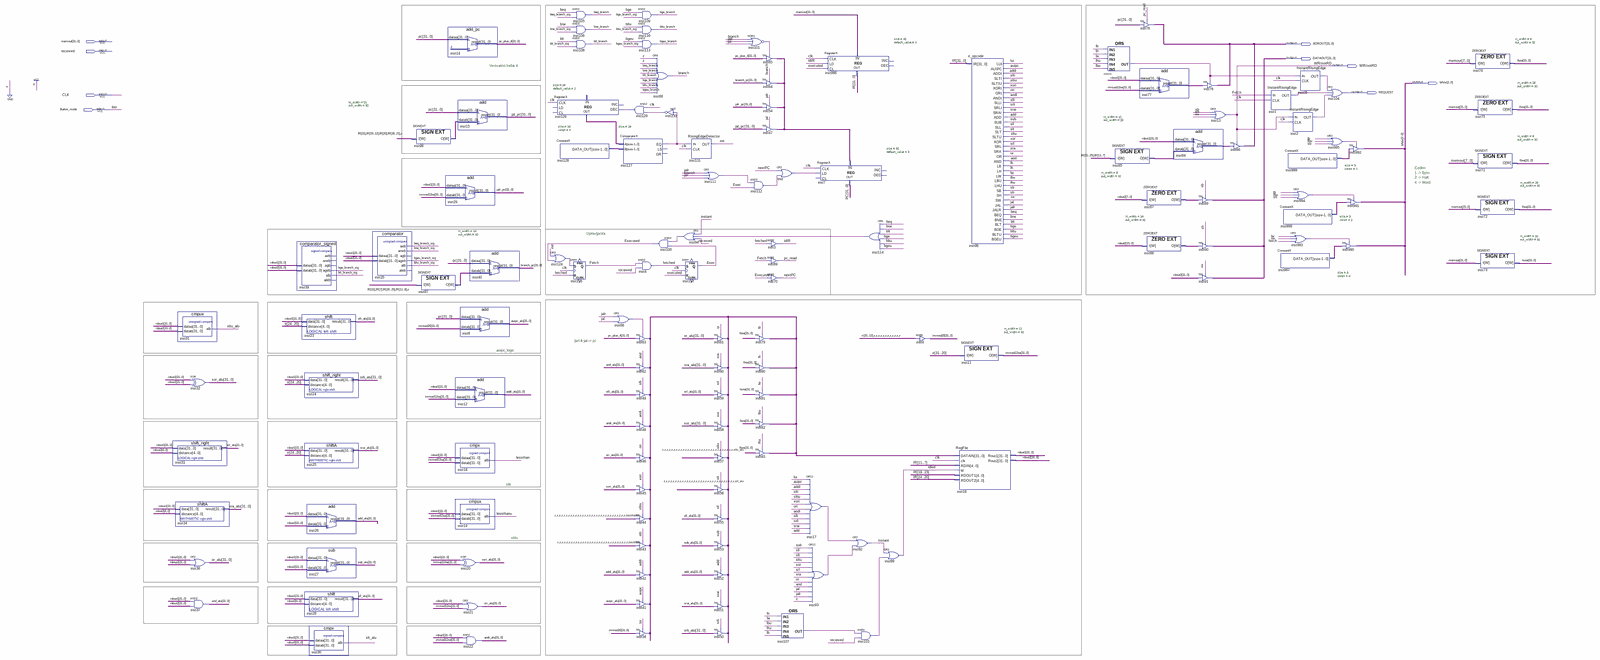
[diagram p0: schematic sheet, whole]
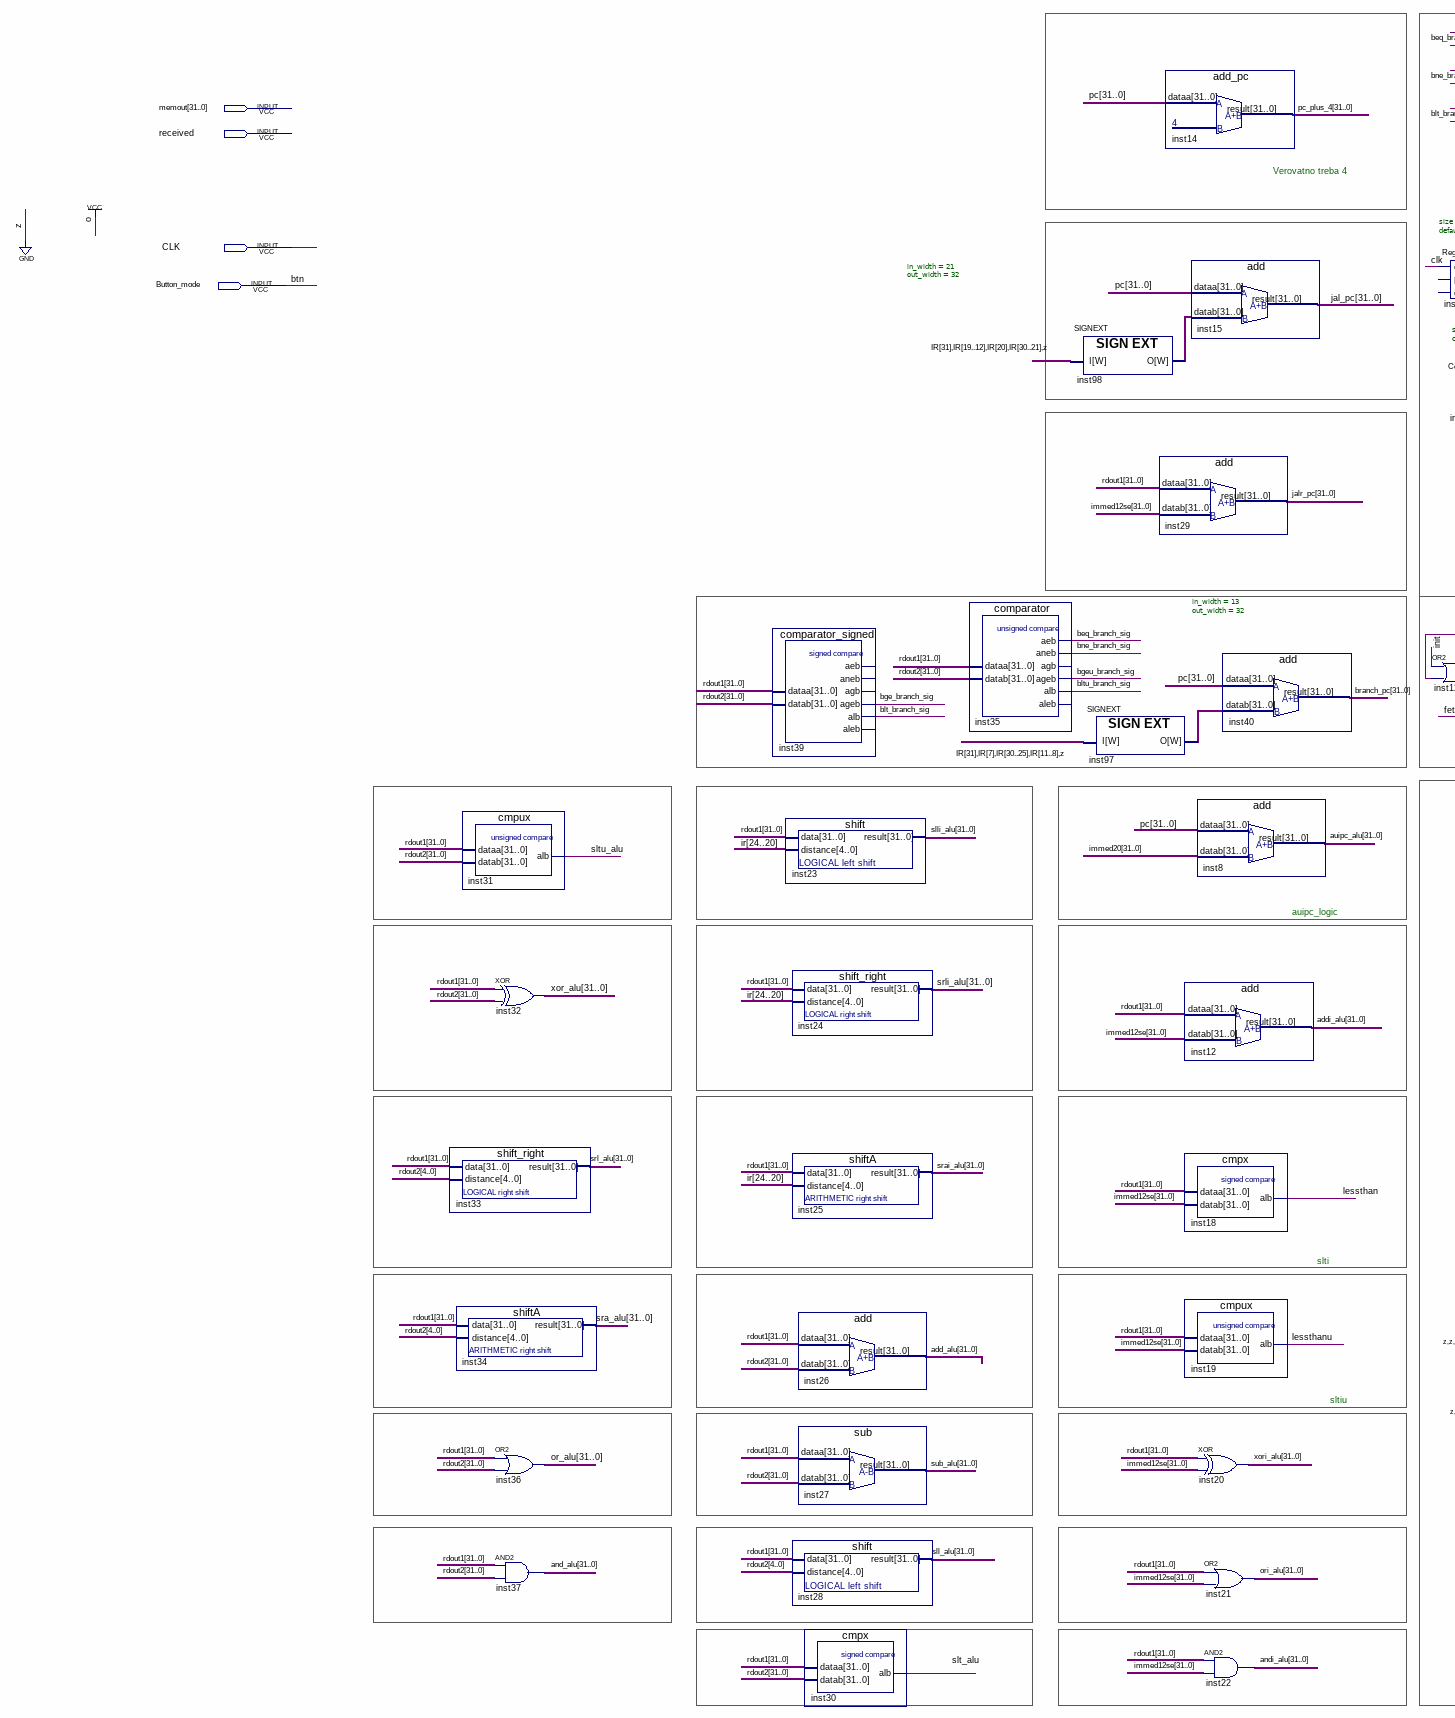
[diagram p1: schematic sheet, left part]
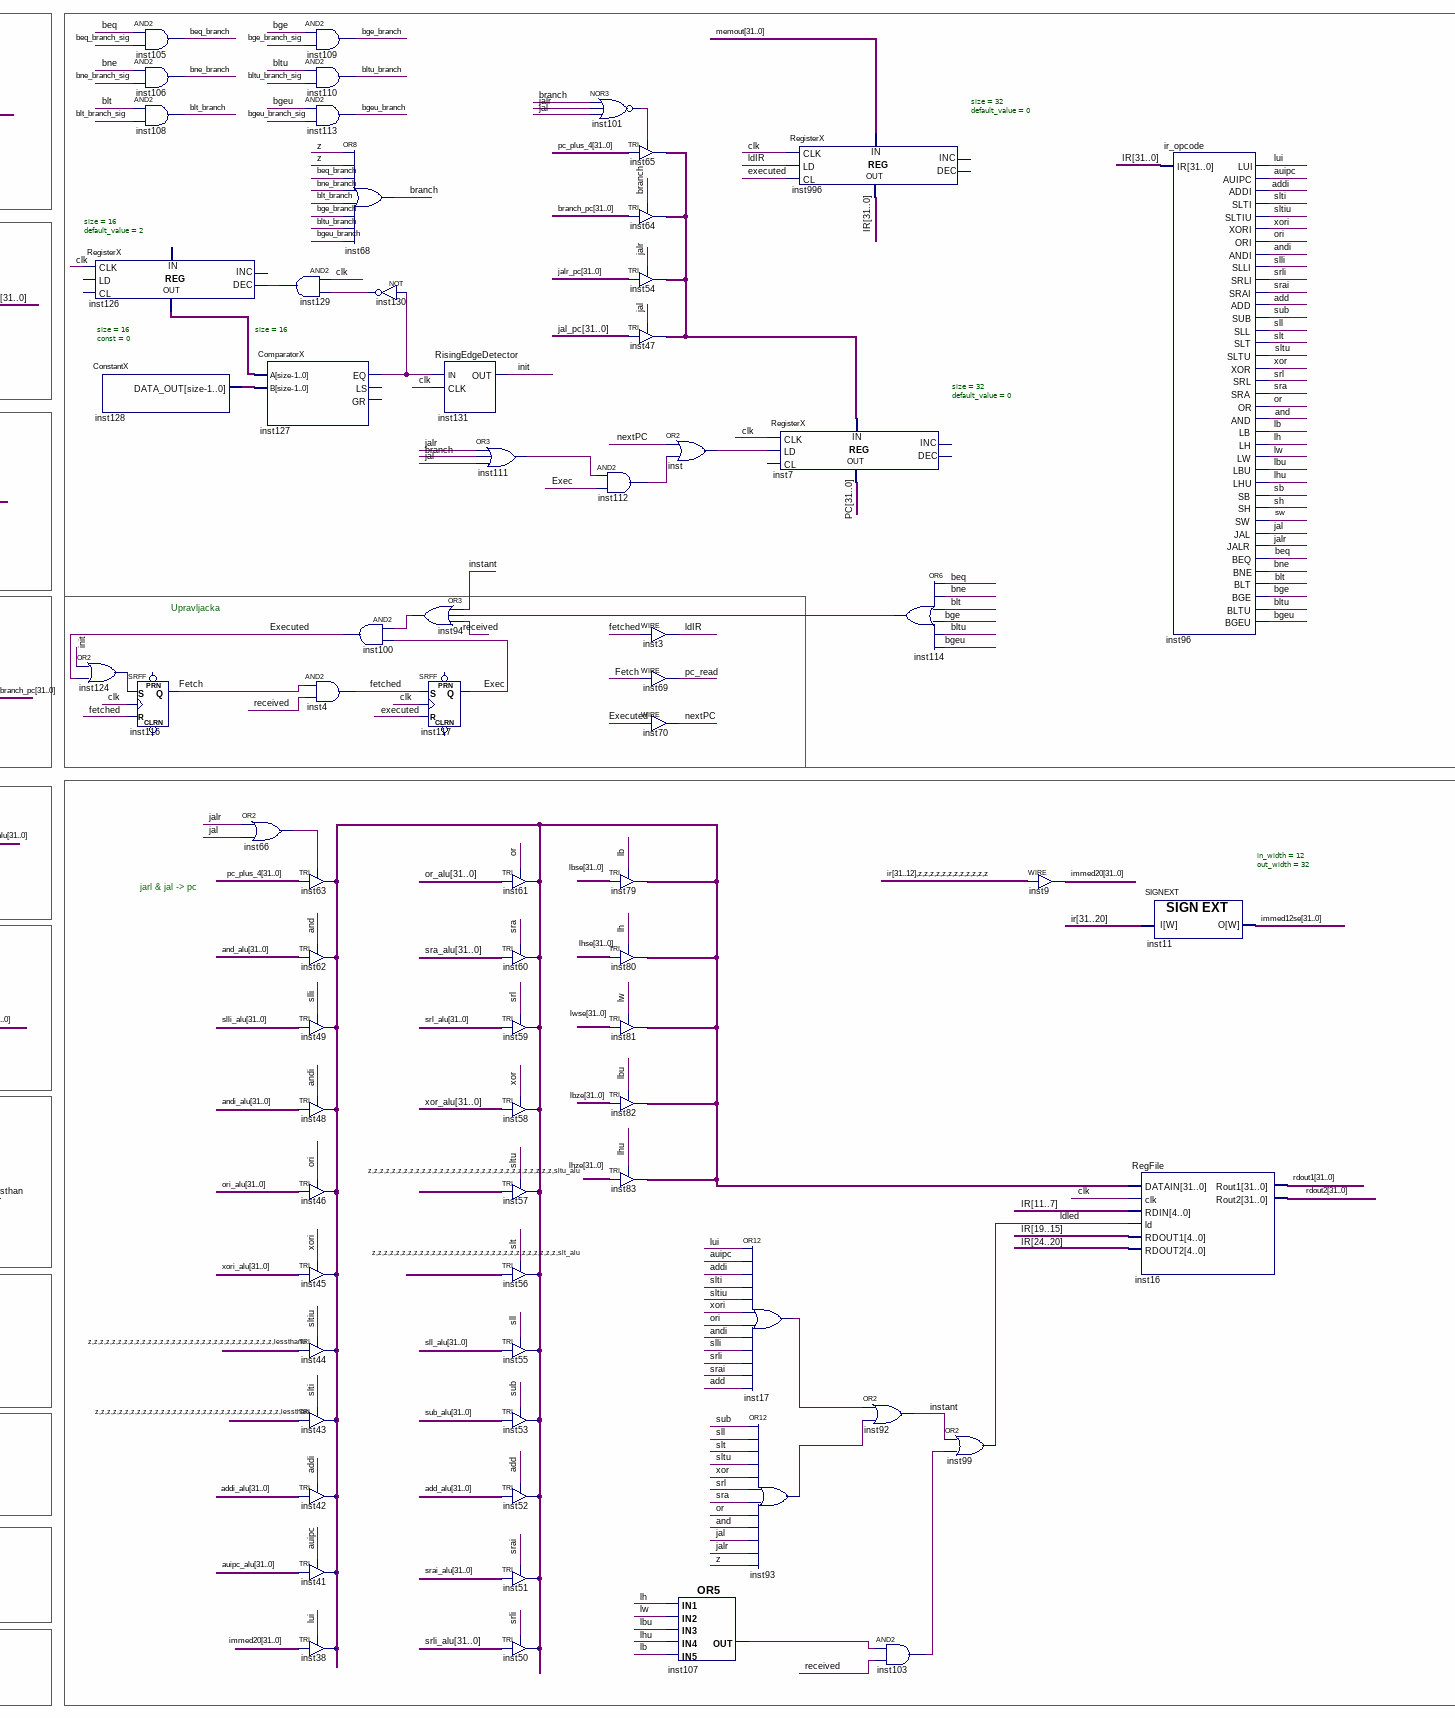
[diagram p2: schematic sheet, centre part]
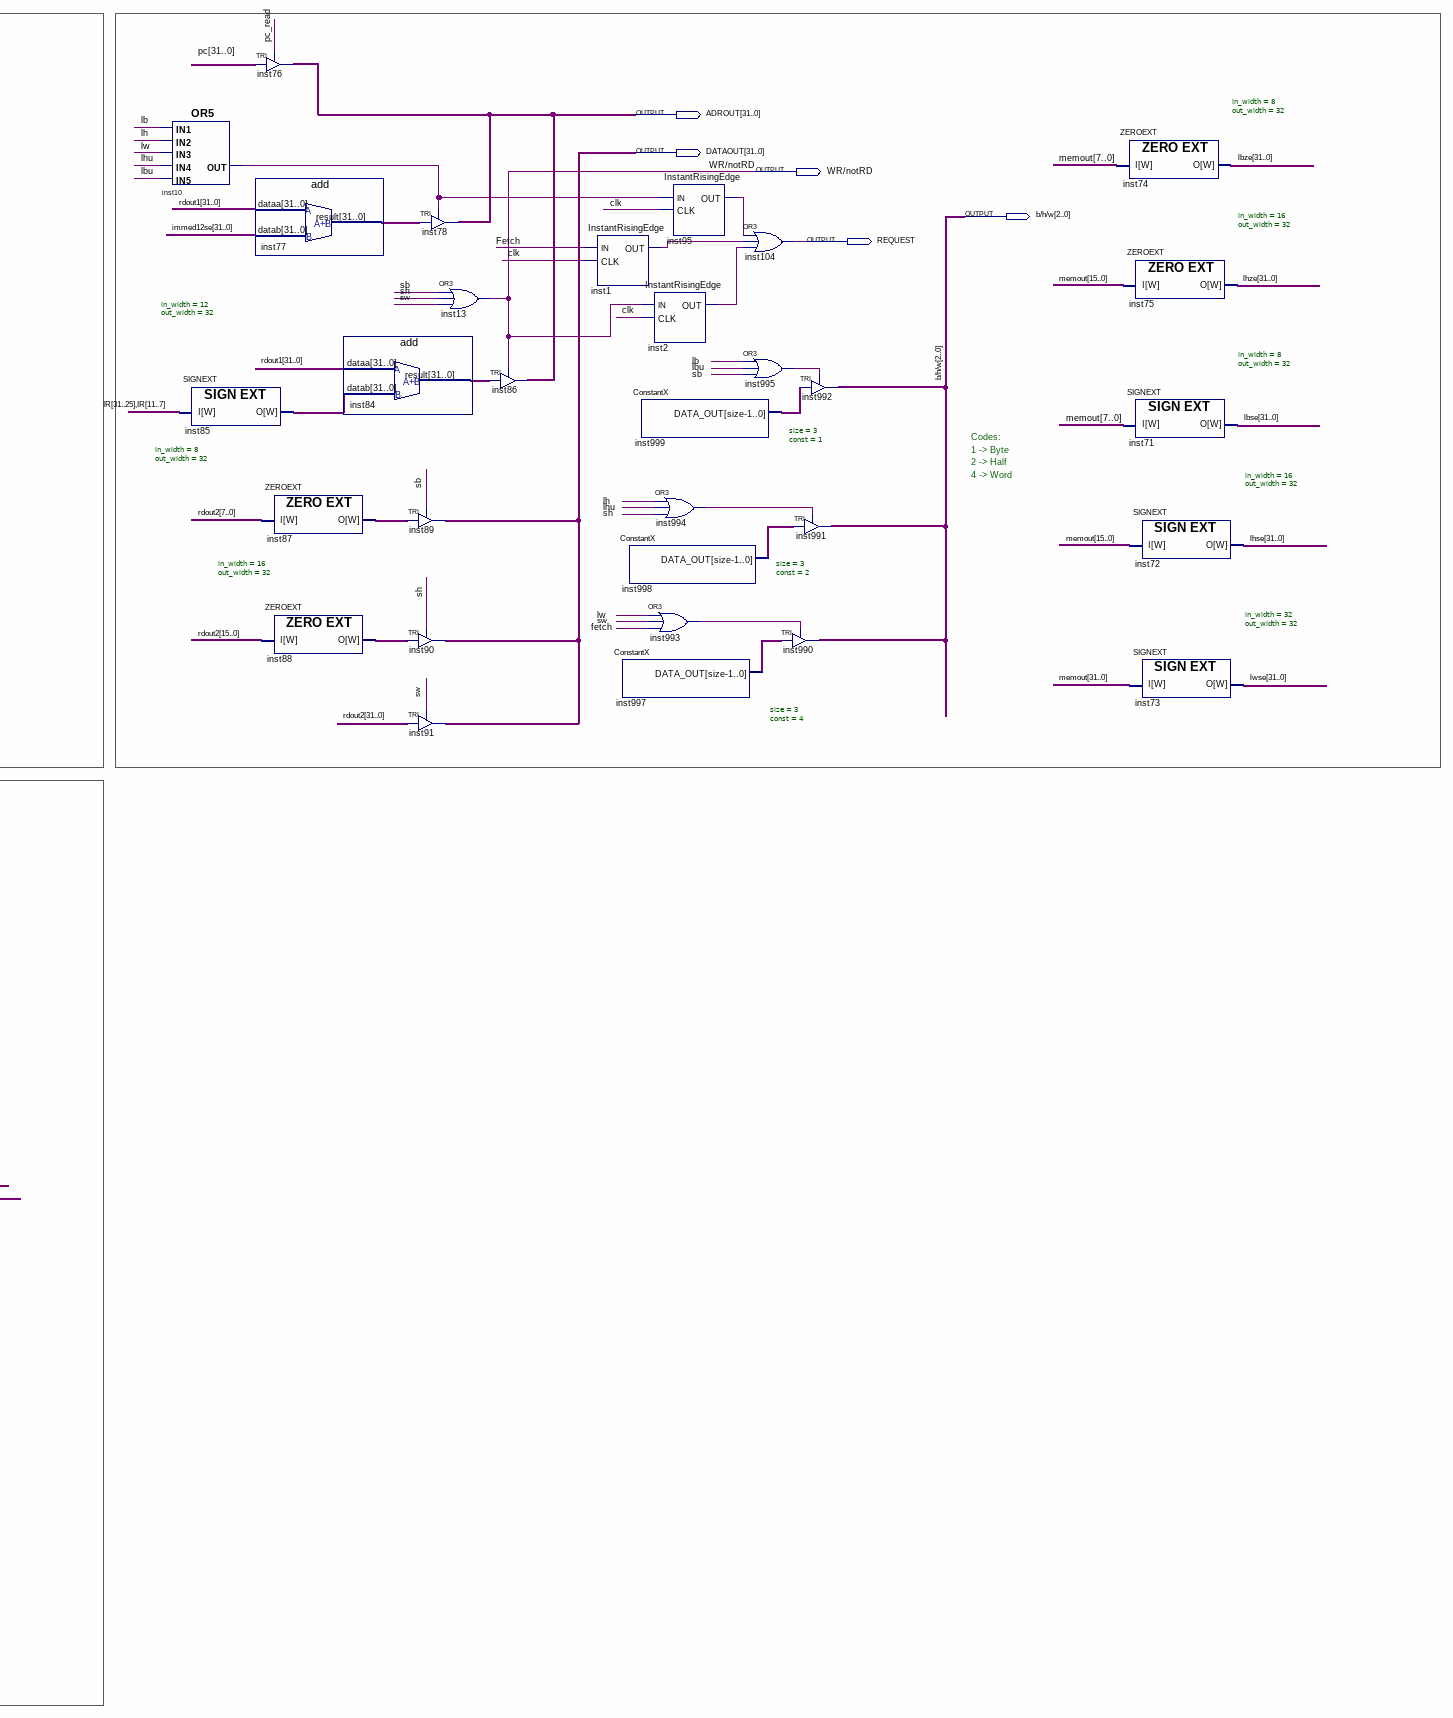
[diagram p3: schematic sheet, right part]
// Quartus schematic CPU.bdf as structural Verilog: 130 symbols, 9 pins
module CPU (
  input  [31:0] memout,
  input  received,
  input  CLK,
  input  Button_mode,
  output [31:0] ADROUT,
  output [31:0] DATAOUT,
  output \WR/notRD ,
  output [2:0] \b/h/w ,
  output REQUEST
);

  wire add, addi, \and , andi, auipc, beq, beq_branch, beq_branch_sig, bge, bge_branch, bge_branch_sig, bgeu,
       bgeu_branch, bgeu_branch_sig, blt, blt_branch, blt_branch_sig, bltu, bltu_branch, bltu_branch_sig,
       bne, bne_branch, bne_branch_sig, branch, Exec, Executed, Fetch, fetched, init, inst1_out, inst2_out,
       inst10_out, inst17_out, inst66_out, inst93_out, inst94_out, inst95_out, inst101_out, inst103_out,
       inst107_out, inst111_out, inst112_out, inst114_out, inst124_out, inst127_eq, inst129_out, inst130_out,
       inst993_out, inst994_out, inst995_out, inst_out, instant, jal, jalr, lb, lbu, ldIR, ldled, lessthan,
       lessthanu, lh, lhu, lui, lw, nextPC, \or , ori, pc_read, sb, sh, sll, slli, slt, slt_alu, slti, sltiu,
       sltu, sltu_alu, sra, srai, srl, srli, sub, sw, \xor , xori;
  wire [2:0] inst997_data_out, inst998_data_out, inst999_data_out;
  wire [15:0] inst126_data_out, inst128_data_out;
  wire [31:0] add_alu, addi_alu, and_alu, andi_alu, auipc_alu, branch_pc, immed12se, immed20, inst63_out,
       inst65_out, inst77_result, inst84_result, inst85_o, inst87_o, inst88_o, inst97_o, inst98_o, ir,
       jal_pc, jalr_pc, lbse, lbze, lhse, lhze, lwse, or_alu, ori_alu, pc, pc_plus_4, rdout1, rdout2,
       sll_alu, slli_alu, sra_alu, srai_alu, srl_alu, srli_alu, sub_alu, xor_alu, xori_alu;

  shift_right inst33 (.data(rdout1), .distance(rdout2[4:0]), .result(srl_alu));
  cmpux inst31 (.dataa(rdout1), .datab(rdout2), .alb(sltu_alu));
  assign xor_alu = rdout1 ^ rdout2;  // XOR inst32, 32 bits wide
  shiftA inst34 (.data(rdout1), .distance(rdout2[4:0]), .result(sra_alu));
  assign or_alu = rdout1 | rdout2;  // OR2 inst36, 32 bits wide
  assign and_alu = rdout1 & rdout2;  // AND2 inst37, 32 bits wide
  comparator_signed inst39 (
    .dataa(rdout1), .datab(rdout2), .ageb(bge_branch_sig), .alb(blt_branch_sig));  // open: aeb, aneb, agb, aleb
  shift inst23 (.data(rdout1), .distance(ir[24:20]), .result(slli_alu));
  shift_right inst24 (.data(rdout1), .distance(ir[24:20]), .result(srli_alu));
  shiftA inst25 (.data(rdout1), .distance(ir[24:20]), .result(srai_alu));
  add inst26 (.dataa(rdout1), .datab(rdout2), .result(add_alu));
  sub inst27 (.dataa(rdout1), .datab(rdout2), .result(sub_alu));
  shift inst28 (.data(rdout1), .distance(rdout2[4:0]), .result(sll_alu));
  cmpx inst30 (.dataa(rdout1), .datab(rdout2), .alb(slt_alu));
  comparator inst35 (
    .dataa(rdout1), .datab(rdout2), .aeb(beq_branch_sig), .aneb(bne_branch_sig), .ageb(bgeu_branch_sig),
    .alb(bltu_branch_sig));  // open: agb, aleb
  SIGNEXT #(.in_width(21), .out_width(32)) inst98 (.I({ir[31], ir[19:12], ir[20], ir[30:21], 1'b0}), .O(inst98_o));
  SIGNEXT #(.in_width(13), .out_width(32)) inst97 (.I({ir[31], ir[7], ir[30:25], ir[11:8], 1'b0}), .O(inst97_o));
  add inst29 (.dataa(rdout1), .datab(immed12se), .result(jalr_pc));
  add_pc inst14 (.dataa(pc), .result(pc_plus_4));
  add inst15 (.dataa(pc), .datab(inst98_o), .result(jal_pc));
  add inst8 (.dataa(pc), .datab(immed20), .result(auipc_alu));
  add inst12 (.dataa(rdout1), .datab(immed12se), .result(addi_alu));
  cmpx inst18 (.dataa(rdout1), .datab(immed12se), .alb(lessthan));
  cmpux inst19 (.dataa(rdout1), .datab(immed12se), .alb(lessthanu));
  assign xori_alu = rdout1 ^ immed12se;  // XOR inst20, 32 bits wide
  assign ori_alu = rdout1 | immed12se;  // OR2 inst21, 32 bits wide
  assign andi_alu = rdout1 & immed12se;  // AND2 inst22, 32 bits wide
  add inst40 (.dataa(pc), .datab(inst97_o), .result(branch_pc));
  RegisterX #(.size(16), .default_value(2)) inst126 (
    .CLK(CLK), .DEC(inst129_out), .DATA_OUT(inst126_data_out));  // open: LD, CL, INC, DATA_IN
  ConstantX #(.size(16), .\const (0)) inst128 (.DATA_OUT(inst128_data_out));
  or inst124 (inst124_out, init, Executed);
  and inst105 (beq_branch, beq, beq_branch_sig);
  and inst106 (bne_branch, bne, bne_branch_sig);
  and inst108 (blt_branch, blt, blt_branch_sig);
  SRFF inst116 (.S(inst124_out), .R(fetched), .CLK(CLK), .Q(Fetch));  // open: PRN, CLRN
  ComparatorX #(.size(16)) inst127 (.A(inst126_data_out), .B(inst128_data_out), .EQ(inst127_eq));  // open: LS, GR
  or inst66 (inst66_out, jalr, jal);
  and inst109 (bge_branch, bge, bge_branch_sig);
  and inst110 (bltu_branch, bltu, bltu_branch_sig);
  and inst113 (bgeu_branch, bgeu, bgeu_branch_sig);
  and inst129 (inst129_out, CLK, inst130_out);
  and inst4 (fetched, Fetch, received);
  TRI inst63[31:0] (.IN(pc_plus_4), .OE(inst66_out), .OUT(inst63_out));
  TRI inst62[31:0] (.IN(and_alu), .OE(\and ), .OUT(inst63_out));
  TRI inst49[31:0] (.IN(slli_alu), .OE(slli), .OUT(inst63_out));
  TRI inst48[31:0] (.IN(andi_alu), .OE(andi), .OUT(inst63_out));
  TRI inst46[31:0] (.IN(ori_alu), .OE(ori), .OUT(inst63_out));
  TRI inst45[31:0] (.IN(xori_alu), .OE(xori), .OUT(inst63_out));
  TRI inst44[31:0] (.IN({{31{1'b0}}, lessthanu}), .OE(sltiu), .OUT(inst63_out));
  TRI inst43[31:0] (.IN({{31{1'b0}}, lessthan}), .OE(slti), .OUT(inst63_out));
  TRI inst42[31:0] (.IN(addi_alu), .OE(addi), .OUT(inst63_out));
  TRI inst41[31:0] (.IN(auipc_alu), .OE(auipc), .OUT(inst63_out));
  TRI inst38[31:0] (.IN(immed20), .OE(lui), .OUT(inst63_out));
  or inst68 (branch, 1'b0, 1'b0, beq_branch, bne_branch, blt_branch, bge_branch, bltu_branch, bgeu_branch);
  and inst100 (Executed, inst94_out, Exec);
  not inst130 (inst130_out, inst127_eq);
  or inst94 (inst94_out, instant, inst114_out, received);
  RisingEdgeDetector inst131 (.IN(inst127_eq), .CLK(CLK), .OUT(init));
  SRFF inst117 (.S(fetched), .R(Executed), .CLK(CLK), .Q(Exec));  // open: PRN, CLRN
  or inst111 (inst111_out, jalr, branch, jal);
  TRI inst61[31:0] (.IN(or_alu), .OE(\or ), .OUT(inst63_out));
  TRI inst60[31:0] (.IN(sra_alu), .OE(sra), .OUT(inst63_out));
  TRI inst59[31:0] (.IN(srl_alu), .OE(srl), .OUT(inst63_out));
  TRI inst58[31:0] (.IN(xor_alu), .OE(\xor ), .OUT(inst63_out));
  TRI inst57[31:0] (.IN({{31{1'b0}}, sltu_alu}), .OE(sltu), .OUT(inst63_out));
  TRI inst56[31:0] (.IN({{31{1'b0}}, slt_alu}), .OE(slt), .OUT(inst63_out));
  TRI inst55[31:0] (.IN(sll_alu), .OE(sll), .OUT(inst63_out));
  TRI inst53[31:0] (.IN(sub_alu), .OE(sub), .OUT(inst63_out));
  TRI inst52[31:0] (.IN(add_alu), .OE(add), .OUT(inst63_out));
  TRI inst51[31:0] (.IN(srai_alu), .OE(srai), .OUT(inst63_out));
  TRI inst50[31:0] (.IN(srli_alu), .OE(srli), .OUT(inst63_out));
  nor inst101 (inst101_out, branch, jalr, jal);
  and inst112 (inst112_out, inst111_out, Exec);
  TRI inst79[31:0] (.IN(lbse), .OE(lb), .OUT(inst63_out));
  TRI inst80[31:0] (.IN(lhse), .OE(lh), .OUT(inst63_out));
  TRI inst81[31:0] (.IN(lwse), .OE(lw), .OUT(inst63_out));
  TRI inst82[31:0] (.IN(lbze), .OE(lbu), .OUT(inst63_out));
  TRI inst83[31:0] (.IN(lhze), .OE(lhu), .OUT(inst63_out));
  TRI inst65[31:0] (.IN(pc_plus_4), .OE(inst101_out), .OUT(inst65_out));
  TRI inst64[31:0] (.IN(branch_pc), .OE(branch), .OUT(inst65_out));
  TRI inst54[31:0] (.IN(jalr_pc), .OE(jalr), .OUT(inst65_out));
  TRI inst47[31:0] (.IN(jal_pc), .OE(jal), .OUT(inst65_out));
  or inst (inst_out, nextPC, inst112_out);
  assign ldIR = fetched;  // WIRE inst3
  assign pc_read = Fetch;  // WIRE inst69
  assign nextPC = Executed;  // WIRE inst70
  or inst107 (inst107_out, lh, lw, lbu, lhu, lb);
  RegisterX #(.size(32), .default_value(0)) inst7 (
    .CLK(CLK), .LD(inst_out), .DATA_IN(inst65_out), .DATA_OUT(pc));  // open: CL, INC, DEC
  or inst17 (inst17_out, lui, auipc, addi, slti, sltiu, xori, ori, andi, slli, srli, srai, add);
  or inst93 (inst93_out, sub, sll, slt, sltu, \xor , srl, sra, \or , \and , jal, jalr, 1'b0);
  RegisterX #(.size(32), .default_value(0)) inst996 (
    .CLK(CLK), .LD(ldIR), .CL(Executed), .DATA_IN(memout), .DATA_OUT(ir));  // open: INC, DEC
  or inst92 (instant, inst17_out, inst93_out);
  or inst114 (inst114_out, beq, bne, blt, bge, bltu, bgeu);
  and inst103 (inst103_out, inst107_out, received);
  or inst99 (ldled, instant, inst103_out);
  assign immed20 = {ir[31:12], {12{1'b0}}};  // WIRE inst9
  ir_opcode inst96 (
    .IR(ir), .LUI(lui), .AUIPC(auipc), .ADDI(addi), .SLTI(slti), .SLTIU(sltiu), .XORI(xori), .ORI(ori),
    .ANDI(andi), .SLLI(slli), .SRLI(srli), .SRAI(srai), .ADD(add), .SUB(sub), .SLL(sll), .SLT(slt),
    .SLTU(sltu), .XOR(\xor ), .SRL(srl), .SRA(sra), .OR(\or ), .AND(\and ), .LB(lb), .LH(lh), .LW(lw),
    .LBU(lbu), .LHU(lhu), .SB(sb), .SH(sh), .SW(sw), .JAL(jal), .JALR(jalr), .BEQ(beq), .BNE(bne), .BLT(blt),
    .BGE(bge), .BLTU(bltu), .BGEU(bgeu));
  SIGNEXT #(.in_width(12), .out_width(32)) inst11 (.I(ir[31:20]), .O(immed12se));
  RegFile inst16 (
    .DATAIN(inst63_out), .clk(CLK), .RDIN(ir[11:7]), .ld(ldled), .RDOUT1(ir[19:15]), .RDOUT2(ir[24:20]),
    .Rout1(rdout1), .Rout2(rdout2));
  or inst10 (inst10_out, lb, lh, lw, lhu, lbu);
  SIGNEXT #(.in_width(12), .out_width(32)) inst85 (.I({ir[31:25], ir[11:7]}), .O(inst85_o));
  TRI inst76[31:0] (.IN(pc), .OE(pc_read), .OUT(ADROUT));
  add inst77 (.dataa(rdout1), .datab(immed12se), .result(inst77_result));
  ZEROEXT #(.in_width(8), .out_width(32)) inst87 (.I(rdout2[7:0]), .O(inst87_o));
  ZEROEXT #(.in_width(16), .out_width(32)) inst88 (.I(rdout2[15:0]), .O(inst88_o));
  add inst84 (.dataa(rdout1), .datab(inst85_o), .result(inst84_result));
  TRI inst78[31:0] (.IN(inst77_result), .OE(inst10_out), .OUT(ADROUT));
  TRI inst89[31:0] (.IN(inst87_o), .OE(sb), .OUT(DATAOUT));
  TRI inst90[31:0] (.IN(inst88_o), .OE(sh), .OUT(DATAOUT));
  TRI inst91[31:0] (.IN(rdout2), .OE(sw), .OUT(DATAOUT));
  or inst13 (\WR/notRD , sb, sh, sw);
  TRI inst86[31:0] (.IN(inst84_result), .OE(\WR/notRD ), .OUT(ADROUT));
  InstantRisingEdge inst1 (.IN(Fetch), .CLK(CLK), .OUT(inst1_out));
  ConstantX #(.size(3), .\const (1)) inst999 (.DATA_OUT(inst999_data_out));
  ConstantX #(.size(3), .\const (2)) inst998 (.DATA_OUT(inst998_data_out));
  ConstantX #(.size(3), .\const (4)) inst997 (.DATA_OUT(inst997_data_out));
  InstantRisingEdge inst95 (.IN(inst10_out), .CLK(CLK), .OUT(inst95_out));
  InstantRisingEdge inst2 (.IN(\WR/notRD ), .CLK(CLK), .OUT(inst2_out));
  or inst994 (inst994_out, lh, lhu, sh);
  or inst993 (inst993_out, lw, sw, Fetch);
  or inst104 (REQUEST, inst95_out, inst1_out, inst2_out);
  or inst995 (inst995_out, lb, lbu, sb);
  TRI inst990[2:0] (.IN(inst997_data_out), .OE(inst993_out), .OUT(\b/h/w ));
  TRI inst992[2:0] (.IN(inst999_data_out), .OE(inst995_out), .OUT(\b/h/w ));
  TRI inst991[2:0] (.IN(inst998_data_out), .OE(inst994_out), .OUT(\b/h/w ));
  ZEROEXT #(.in_width(8), .out_width(32)) inst74 (.I(memout[7:0]), .O(lbze));
  ZEROEXT #(.in_width(16), .out_width(32)) inst75 (.I(memout[15:0]), .O(lhze));
  SIGNEXT #(.in_width(8), .out_width(32)) inst71 (.I(memout[7:0]), .O(lbse));
  SIGNEXT #(.in_width(16), .out_width(32)) inst72 (.I(memout[15:0]), .O(lhse));
  SIGNEXT #(.in_width(32), .out_width(32)) inst73 (.I(memout), .O(lwse));

  // Other names for the same wires on the sheet: btn = Button_mode

  // Notes on the sheet:
  //   Verovatno treba 4
  //   Codes:
  //   1 -> Byte
  //   2 -> Half
  //   4 -> Word
  //   Upravljacka
  //   jarl & jal -> pc
  //   auipc_logic
  //   slti
  //   sltiu
endmodule
